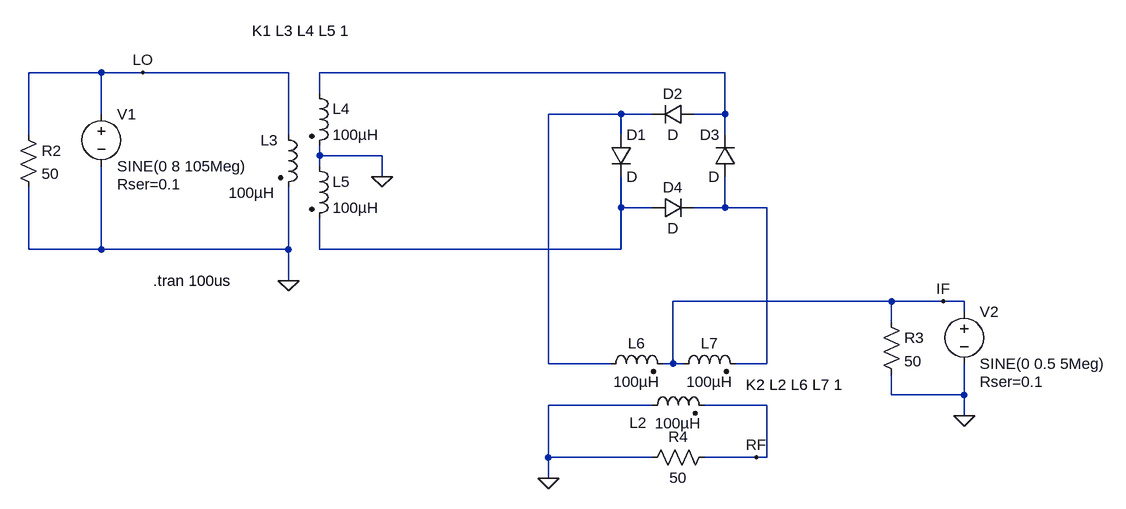
[diagram p0: schematic double_balanced_mixer.asc]
double_balanced_mixer.asc, the LTspice schematic file:
Version 4
SHEET 1 1316 864
WIRE -368 160 -480 160
WIRE -304 160 -368 160
WIRE -80 160 -304 160
WIRE 592 160 -32 160
WIRE -32 192 -32 160
WIRE -368 224 -368 160
WIRE 432 224 320 224
WIRE 480 224 432 224
WIRE 592 224 592 160
WIRE 592 224 544 224
WIRE -480 256 -480 160
WIRE -80 256 -80 160
WIRE 432 256 432 224
WIRE 592 256 592 224
WIRE -32 288 -32 272
WIRE 64 288 -32 288
WIRE -32 304 -32 288
WIRE 64 320 64 288
WIRE 432 368 432 320
WIRE 480 368 432 368
WIRE 592 368 592 320
WIRE 592 368 544 368
WIRE 656 368 592 368
WIRE -480 432 -480 336
WIRE -368 432 -368 304
WIRE -368 432 -480 432
WIRE -80 432 -80 336
WIRE -80 432 -368 432
WIRE -32 432 -32 384
WIRE 432 432 432 368
WIRE 432 432 -32 432
WIRE -80 480 -80 432
WIRE 848 512 512 512
WIRE 928 512 848 512
WIRE 960 512 928 512
WIRE 960 528 960 512
WIRE 848 544 848 512
WIRE 320 608 320 224
WIRE 416 608 320 608
WIRE 512 608 512 512
WIRE 512 608 496 608
WIRE 528 608 512 608
WIRE 656 608 656 368
WIRE 656 608 608 608
WIRE 848 656 848 624
WIRE 960 656 960 608
WIRE 960 656 848 656
WIRE 480 672 320 672
WIRE 656 672 560 672
WIRE 960 688 960 656
WIRE 320 752 320 672
WIRE 480 752 320 752
WIRE 640 752 560 752
WIRE 656 752 656 672
WIRE 656 752 640 752
WIRE 320 784 320 752
FLAG 960 688 0
FLAG -304 160 LO
FLAG 928 512 IF
FLAG 64 320 0
FLAG -80 480 0
FLAG 640 752 RF
FLAG 320 784 0
SYMBOL voltage -368 208 R0
WINDOW 123 0 0 Left 0
WINDOW 39 24 124 Left 2
SYMATTR InstName V1
SYMATTR Value SINE(0 8 105Meg)
SYMATTR SpiceLine Rser=0.1
SYMBOL voltage 960 512 R0
WINDOW 123 0 0 Left 0
WINDOW 39 24 124 Left 2
SYMATTR InstName V2
SYMATTR Value SINE(0 0.5 5Meg)
SYMATTR SpiceLine Rser=0.1
SYMBOL res 832 528 R0
SYMATTR InstName R3
SYMATTR Value 50
SYMBOL ind2 -96 240 R0
WINDOW 0 -27 24 Left 2
WINDOW 3 -76 105 Left 2
SYMATTR InstName L3
SYMATTR Value 100µH
SYMATTR Type ind
SYMBOL ind2 -48 176 R0
SYMATTR InstName L4
SYMATTR Value 100µH
SYMATTR Type ind
SYMBOL ind2 -48 288 R0
SYMATTR InstName L5
SYMATTR Value 100µH
SYMATTR Type ind
SYMBOL res -496 240 R0
SYMATTR InstName R2
SYMATTR Value 50
SYMBOL ind2 464 688 R270
WINDOW 0 -26 -6 VTop 2
WINDOW 3 4 56 VBottom 2
SYMATTR InstName L2
SYMATTR Value 100µH
SYMATTR Type ind
SYMBOL ind2 400 624 R270
WINDOW 0 32 56 VTop 2
WINDOW 3 4 56 VBottom 2
SYMATTR InstName L6
SYMATTR Value 100µH
SYMATTR Type ind
SYMBOL ind2 512 624 R270
WINDOW 0 32 56 VTop 2
WINDOW 3 4 56 VBottom 2
SYMATTR InstName L7
SYMATTR Value 100µH
SYMATTR Type ind
SYMBOL diode 416 256 R0
SYMATTR InstName D1
SYMBOL diode 544 208 R90
WINDOW 0 0 32 VBottom 2
WINDOW 3 32 32 VTop 2
SYMATTR InstName D2
SYMBOL diode 608 320 R180
WINDOW 0 24 64 Left 2
WINDOW 3 24 0 Left 2
SYMATTR InstName D3
SYMBOL diode 480 384 R270
WINDOW 0 32 32 VTop 2
WINDOW 3 0 32 VBottom 2
SYMATTR InstName D4
SYMBOL res 576 736 R90
WINDOW 0 0 56 VBottom 2
WINDOW 3 32 56 VTop 2
SYMATTR InstName R4
SYMATTR Value 50
TEXT -288 480 Left 2 !.tran 100us
TEXT -136 96 Left 2 !K1 L3 L4 L5 1
TEXT 624 640 Left 2 !K2 L2 L6 L7 1

The netlist it stands for:
* double_balanced_mixer.asc
V1 LO 0 SINE(0 8 105Meg) Rser=0.1
V2 IF 0 SINE(0 0.5 5Meg) Rser=0.1
R3 IF 0 50
L3 LO 0 100µH
L4 N001 0 100µH
L5 0 N003 100µH
R2 LO 0 50
L2 0 RF 100µH
L6 N002 IF 100µH
L7 IF N004 100µH
D1 N002 N003 D
D2 N001 N002 D
D3 N004 N001 D
D4 N003 N004 D
R4 RF 0 50
.model D D
.lib standard.dio
.tran 100us
K1 L3 L4 L5 1
K2 L2 L6 L7 1
.backanno
.end